# EAGLE schematic Fake6509_v2 (EAGLE 7.7.0)
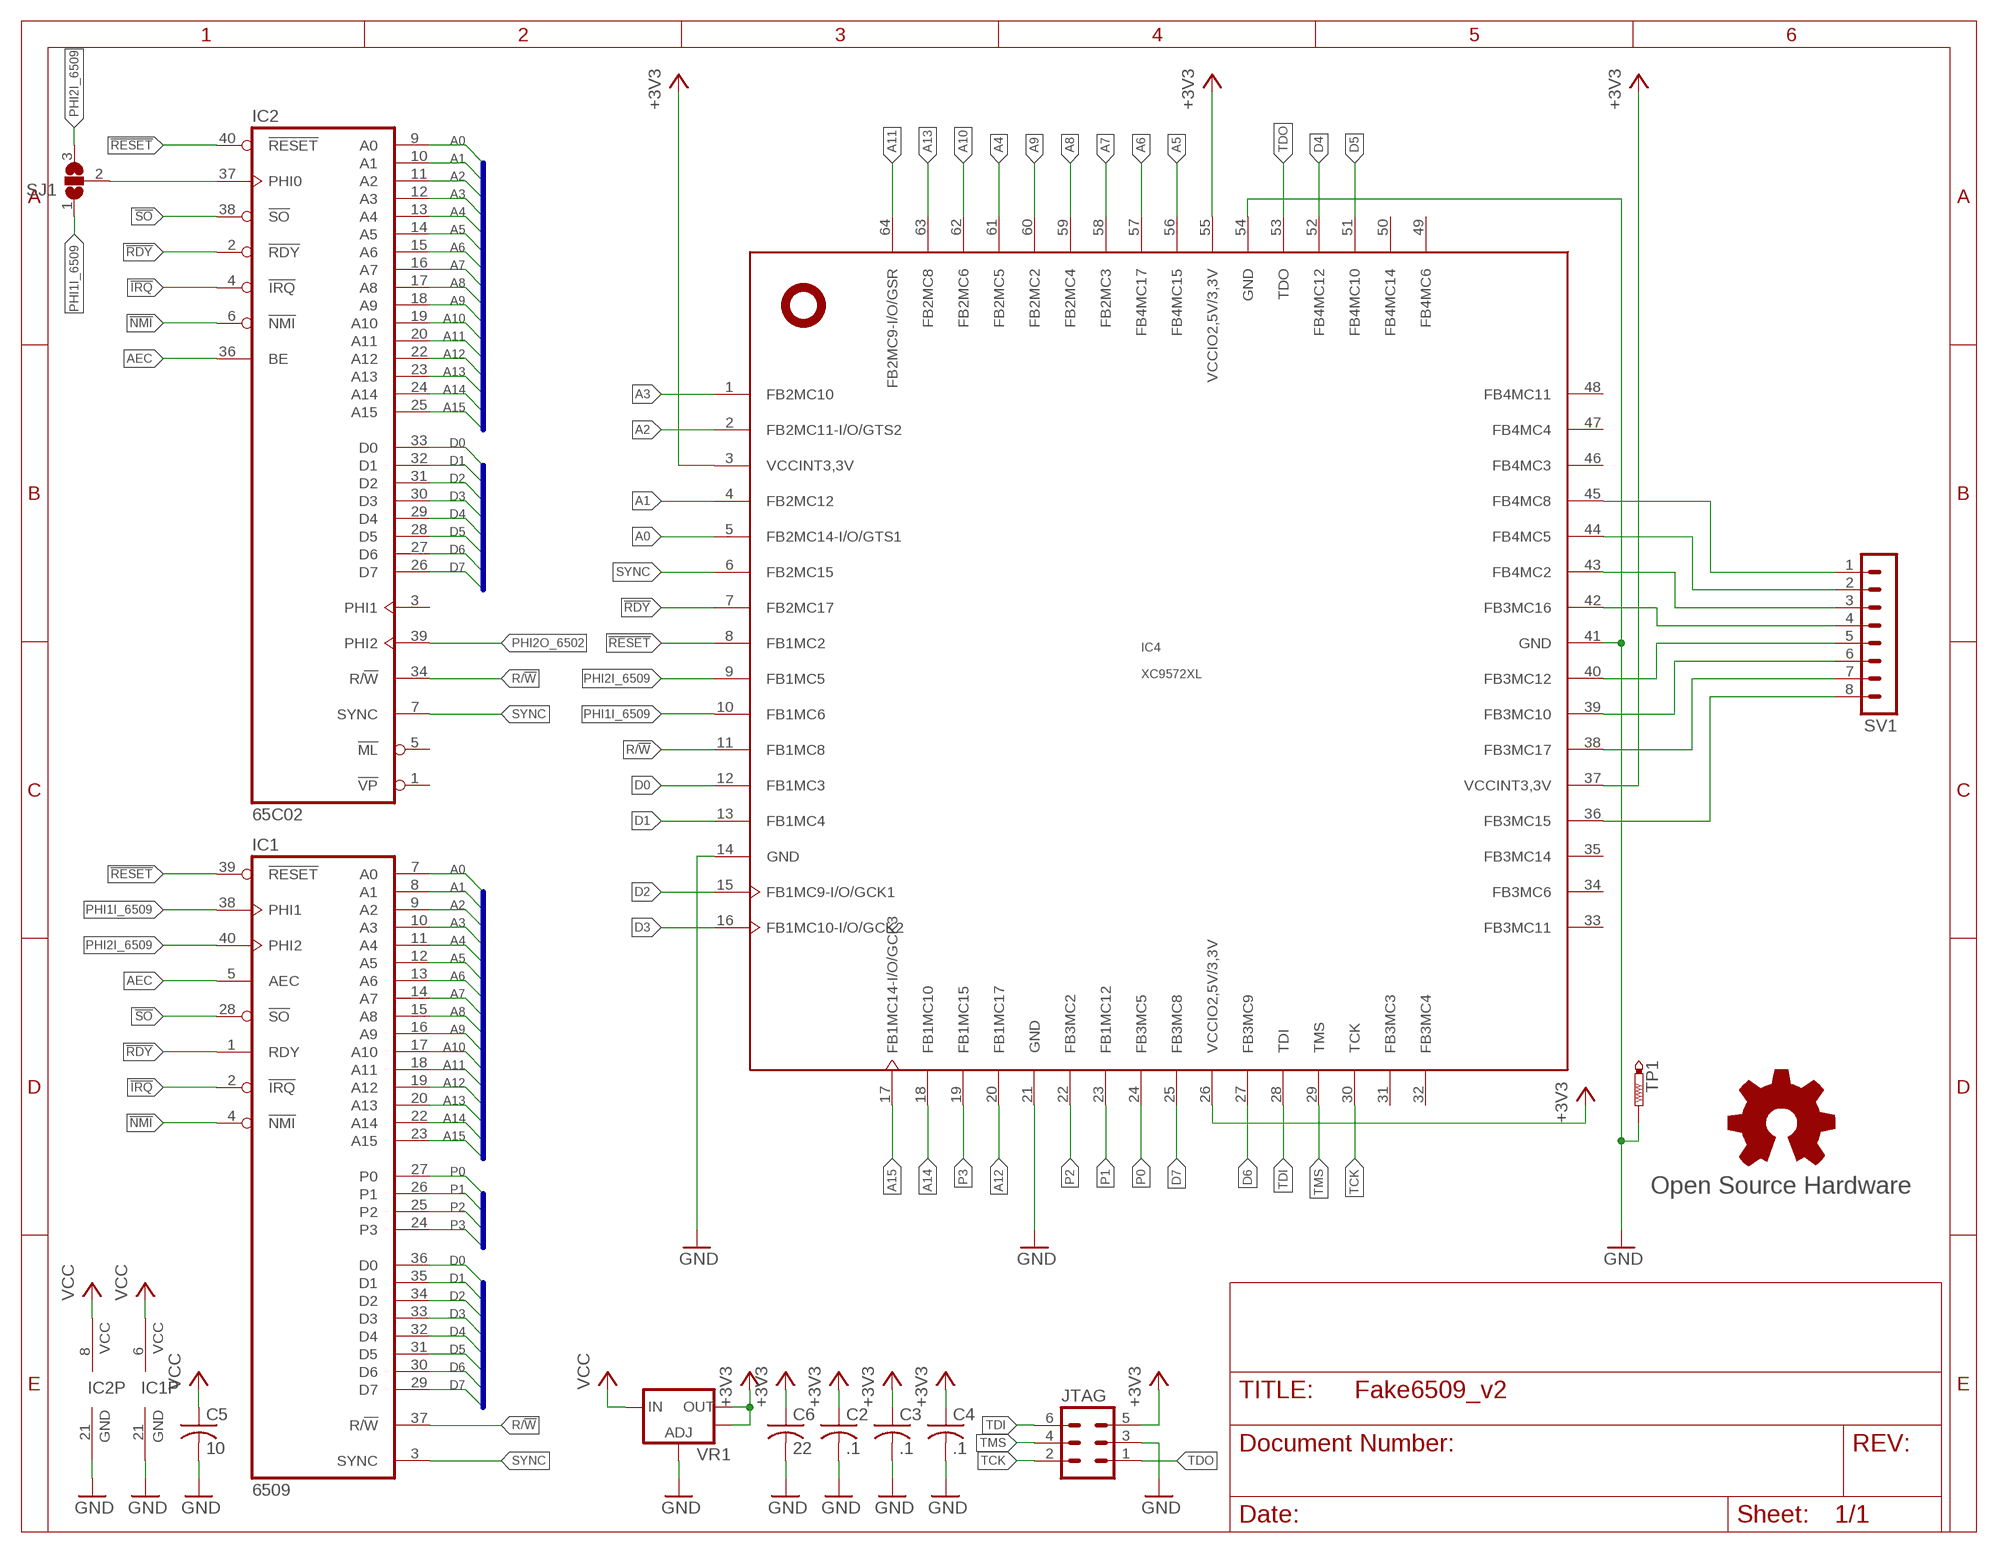
[diagram p0: schematic, sheet 1]

## Parts
C2  .1  C-USC0402  [C0402]
C3  .1  C-USC0402  [C0402]
C4  .1  C-USC0402  [C0402]
C5  10  C-USC0805  [C0805]
C6  22  C-USC0805  [C0805]
GOLD_ORB_SM1  Open Source Hardware  OSHWLOGOLOGO5MM  [OSHW_5MM]
IC1  6509  6509-RP  [DIL40-ROUNDPAD]
IC2  65C02  W65C02SP-R  [DIL40-ROUNDPAD]
IC4  XC9572XL  XC9572XLVQG64  [VQFP64]
JTAG  MA03-2  [MA03-2]
SJ1  SJ2W  [SJ_2]
SV1  MA08-1  [MA08-1]
TP1  PTR1B1,27  [B1,27]
VR1  V_REG_LM1117SOT223  [SOT223]

## Nets
!IRQ: IC1.2(!IRQ) IC2.4(!IRQ)
!NMI: IC1.4(!NMI) IC2.6(!NMI)
!RDY: IC1.1(RDY) IC2.2(!RDY) IC4.7(FB2MC17)
!RESET: IC1.39(!RESET) IC2.40(!RESET) IC4.8(FB1MC2)
!SO: IC1.28(!SO) IC2.38(!SO)
+3V3: C2.1 C3.1 C4.1 C6.1 IC4.3(VCCINT3,3V) IC4.26(VCCIO2,5V/3,3V) IC4.37(VCCINT3,3V) IC4.55(VCCIO2,5V/3,3V) JTAG.5 VR1.2(OUT) VR1.4(OUT)
A0: IC1.7(A0) IC2.9(A0) IC4.5(FB2MC14-I/O/GTS1)
A1: IC1.8(A1) IC2.10(A1) IC4.4(FB2MC12)
A2: IC1.9(A2) IC2.11(A2) IC4.2(FB2MC11-I/O/GTS2)
A3: IC1.10(A3) IC2.12(A3) IC4.1(FB2MC10)
A4: IC1.11(A4) IC2.13(A4) IC4.61(FB2MC5)
A5: IC1.12(A5) IC2.14(A5) IC4.56(FB4MC15)
A6: IC1.13(A6) IC2.15(A6) IC4.57(FB4MC17)
A7: IC1.14(A7) IC2.16(A7) IC4.58(FB2MC3)
A8: IC1.15(A8) IC2.17(A8) IC4.59(FB2MC4)
A9: IC1.16(A9) IC2.18(A9) IC4.60(FB2MC2)
A10: IC1.17(A10) IC2.19(A10) IC4.62(FB2MC6)
A11: IC1.18(A11) IC2.20(A11) IC4.64(FB2MC9-I/O/GSR)
A12: IC1.19(A12) IC2.22(A12) IC4.20(FB1MC17)
A13: IC1.20(A13) IC2.23(A13) IC4.63(FB2MC8)
A14: IC1.22(A14) IC2.24(A14) IC4.18(FB1MC10)
A15: IC1.23(A15) IC2.25(A15) IC4.17(FB1MC14-I/O/GCK3)
AEC: IC1.5(AEC) IC2.36(BE)
D0: IC1.36(D0) IC2.33(D0) IC4.12(FB1MC3)
D1: IC1.35(D1) IC2.32(D1) IC4.13(FB1MC4)
D2: IC1.34(D2) IC2.31(D2) IC4.15(FB1MC9-I/O/GCK1)
D3: IC1.33(D3) IC2.30(D3) IC4.16(FB1MC10-I/O/GCK2)
D4: IC1.32(D4) IC2.29(D4) IC4.52(FB4MC12)
D5: IC1.31(D5) IC2.28(D5) IC4.51(FB4MC10)
D6: IC1.30(D6) IC2.27(D6) IC4.27(FB3MC9)
D7: IC1.29(D7) IC2.26(D7) IC4.25(FB3MC8)
GND: C2.2 C3.2 C4.2 C5.2 C6.2 IC1.21(GND) IC2.21(GND) IC4.14(GND) IC4.21(GND) IC4.41(GND) IC4.54(GND) JTAG.3 TP1.TP VR1.1(ADJ)
N$1: IC4.40(FB3MC12) SV1.5
N$2: IC4.42(FB3MC16) SV1.4
N$4: IC4.43(FB4MC2) SV1.3
N$5: IC4.44(FB4MC5) SV1.2
N$6: IC4.45(FB4MC8) SV1.1
N$7: IC4.39(FB3MC10) SV1.6
N$8: IC4.38(FB3MC17) SV1.7
N$9: IC4.36(FB3MC15) SV1.8
P0: IC1.27(P0) IC4.24(FB3MC5)
P1: IC1.26(P1) IC4.23(FB1MC12)
P2: IC1.25(P2) IC4.22(FB3MC2)
P3: IC1.24(P3) IC4.19(FB1MC15)
PHI1I_6509: IC1.38(PHI1) IC4.10(FB1MC6) SJ1.1
PHI2I_6502: IC2.37(PHI0) SJ1.2
PHI2I_6509: IC1.40(PHI2) IC4.9(FB1MC5) SJ1.3
PHI2O_6502: IC2.39(PHI2)
R/!W: IC1.37(R/!W) IC2.34(R/!W) IC4.11(FB1MC8)
SYNC: IC1.3(SYNC) IC2.7(SYNC) IC4.6(FB2MC15)
TCK: IC4.30(TCK) JTAG.2
TDI: IC4.28(TDI) JTAG.6
TDO: IC4.53(TDO) JTAG.1
TMS: IC4.29(TMS) JTAG.4
VCC: C5.1 IC1.6(VCC) IC2.8(VCC) VR1.3(IN)
Unconnected: IC2.1(!VP) IC2.3(PHI1) IC2.5(!ML) IC4.31(FB3MC3) IC4.32(FB3MC4) IC4.33(FB3MC11) IC4.34(FB3MC6) IC4.35(FB3MC14) IC4.46(FB4MC3) IC4.47(FB4MC4) IC4.48(FB4MC11) IC4.49(FB4MC6) IC4.50(FB4MC14)

## Buses
A[0..15]
D[0..7]
P[0..3]

## Library data of the parts
C2-C6 = rcl:C-US: CAPACITOR, American symbol
GOLD_ORB_SM1 = oshw:OSHWLOGO: The OSHW logo for PCB layout
IC1 = commodore:6509
IC2 = commodore:W65C02SP: Western Digital Version
IC4 = xilinx_xc95XXXxl:XC9572XLVQG64
JTAG = con-lstb:MA03-2: PIN HEADER; OC_FARNELL: unknown; OC_NEWARK: unknown
SJ1 = jumper:SJ2W: SMD solder JUMPER
SV1 = con-lstb:MA08-1: PIN HEADER; OC_FARNELL: unknown; OC_NEWARK: unknown
TP1 = testpad:PTR1: TEST PIN
VR1 = SparkFun:V_REG_LM1117: Voltage Regulator LM1117 Standard adjustable voltage regulator but in SMD form. Spark Fun Electronics SKU : COM-00595